# EAGLE design weather (EAGLE 8.2.1)
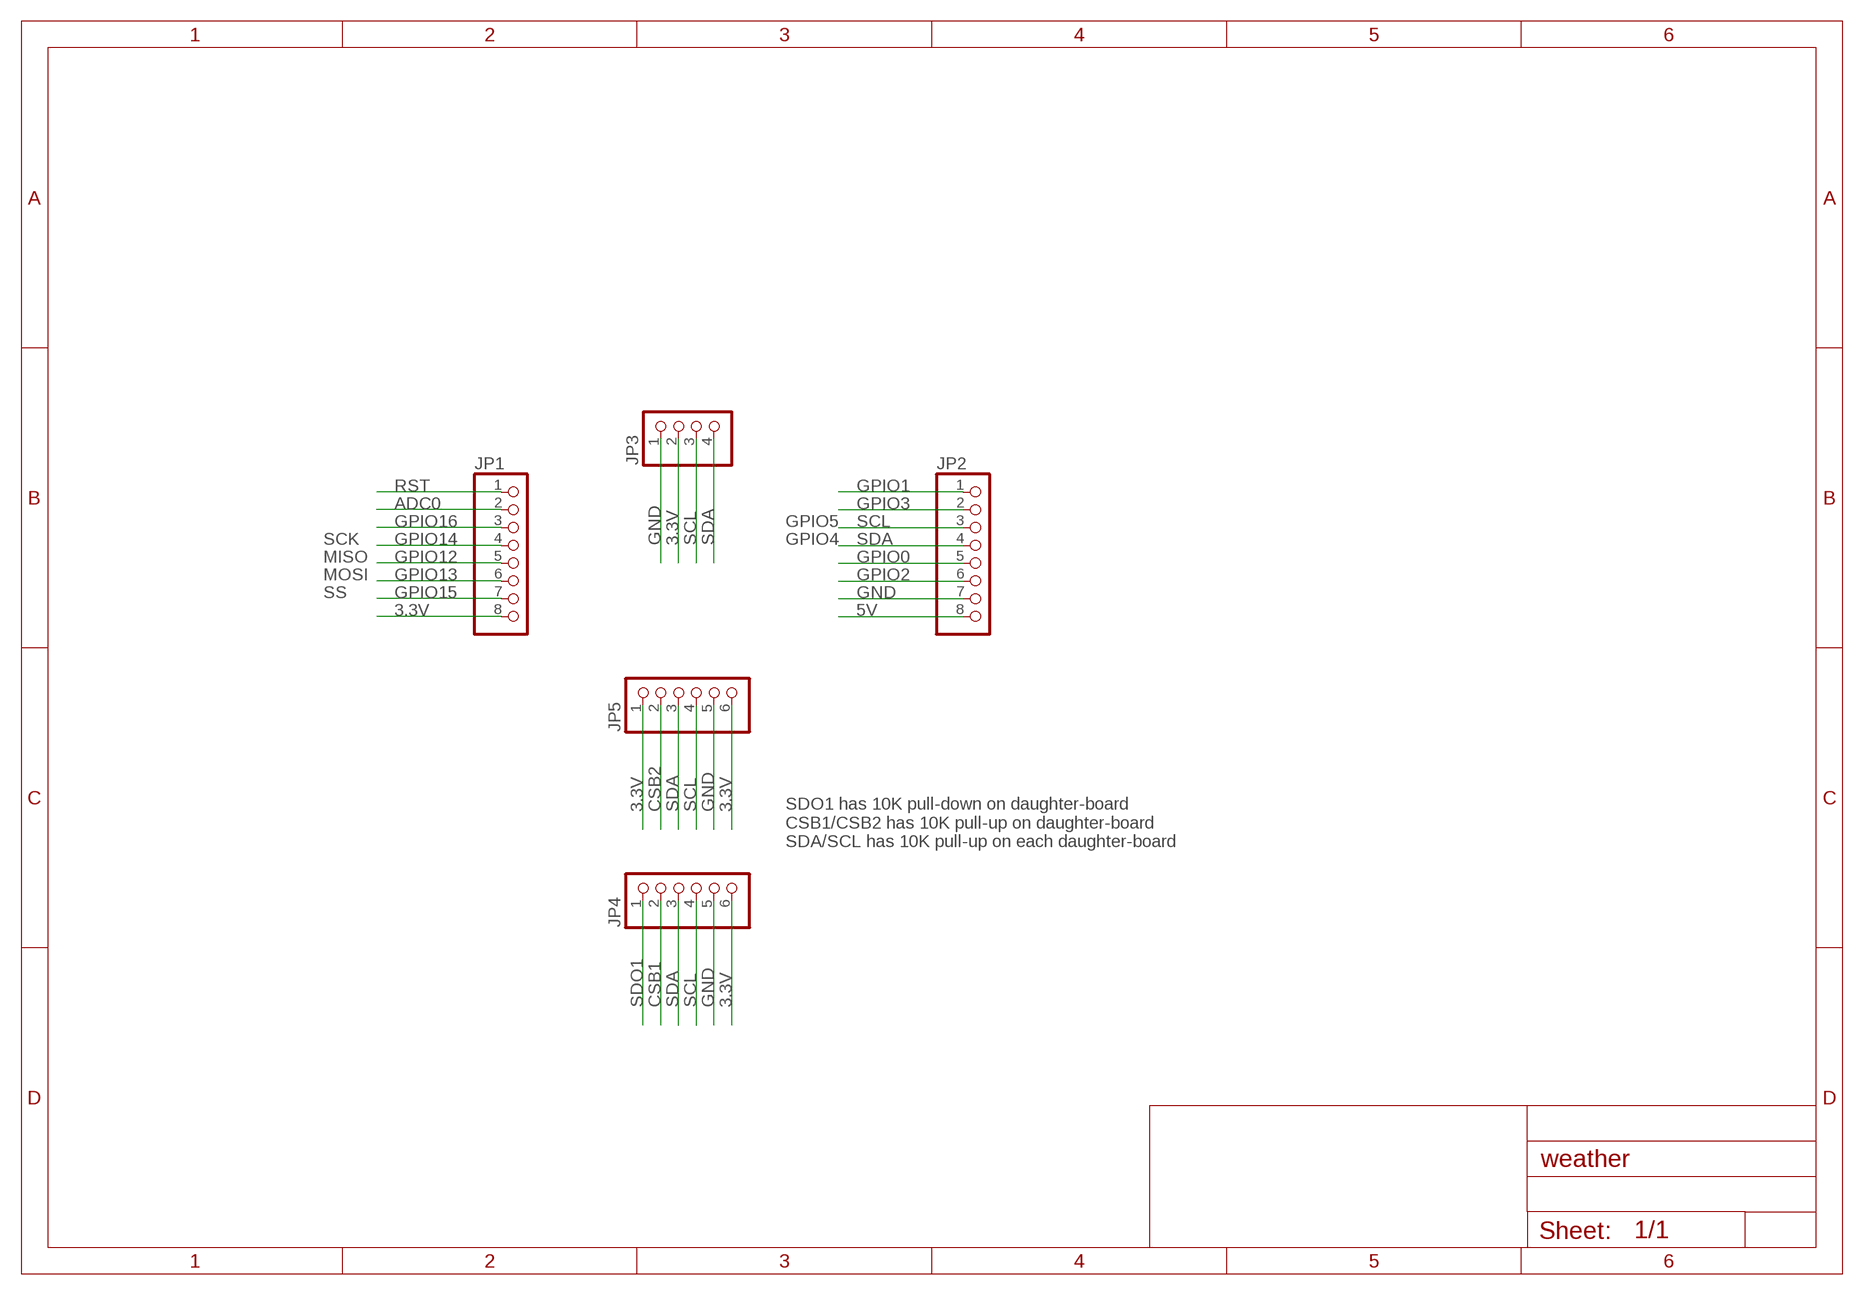
[diagram p0: schematic, sheet 1]

## Parts
JP1  PINHD-1X8  [1X08]
JP2  PINHD-1X8  [1X08]
JP3  PINHD-1X4  [1X04]
JP4  PINHD-1X6  [1X06]
JP5  PINHD-1X6  [1X06]

## Nets
3.3V: JP1.8 JP3.2 JP4.6 JP5.1 JP5.6
5V: JP2.8
ADC0: JP1.2
CSB1: JP4.2
CSB2: JP5.2
GND: JP2.7 JP3.1 JP4.5 JP5.5
GPIO0: JP2.5
GPIO1: JP2.1
GPIO2: JP2.6
GPIO3: JP2.2
GPIO12: JP1.5
GPIO13: JP1.6
GPIO14: JP1.4
GPIO15: JP1.7
GPIO16: JP1.3
RST: JP1.1
SCL: JP2.3 JP3.3 JP4.4 JP5.4
SDA: JP2.4 JP3.4 JP4.3 JP5.3
SDO1: JP4.1

## Notes on the sheet
- GPIO5
- SCK | GPIO4
- MISO
- MOSI
- SS
- SDO1 has 10K pull-down on daughter-board
  CSB1/CSB2 has 10K pull-up on daughter-board
  SDA/SCL has 10K pull-up on each daughter-board

## Library data of the parts
JP1 JP2 = pinhead:PINHD-1X8: PIN HEADER
JP3 = pinhead:PINHD-1X4: PIN HEADER
JP4 JP5 = pinhead:PINHD-1X6: PIN HEADER

## Net classes
0 default: width 0.508 mm

## Board
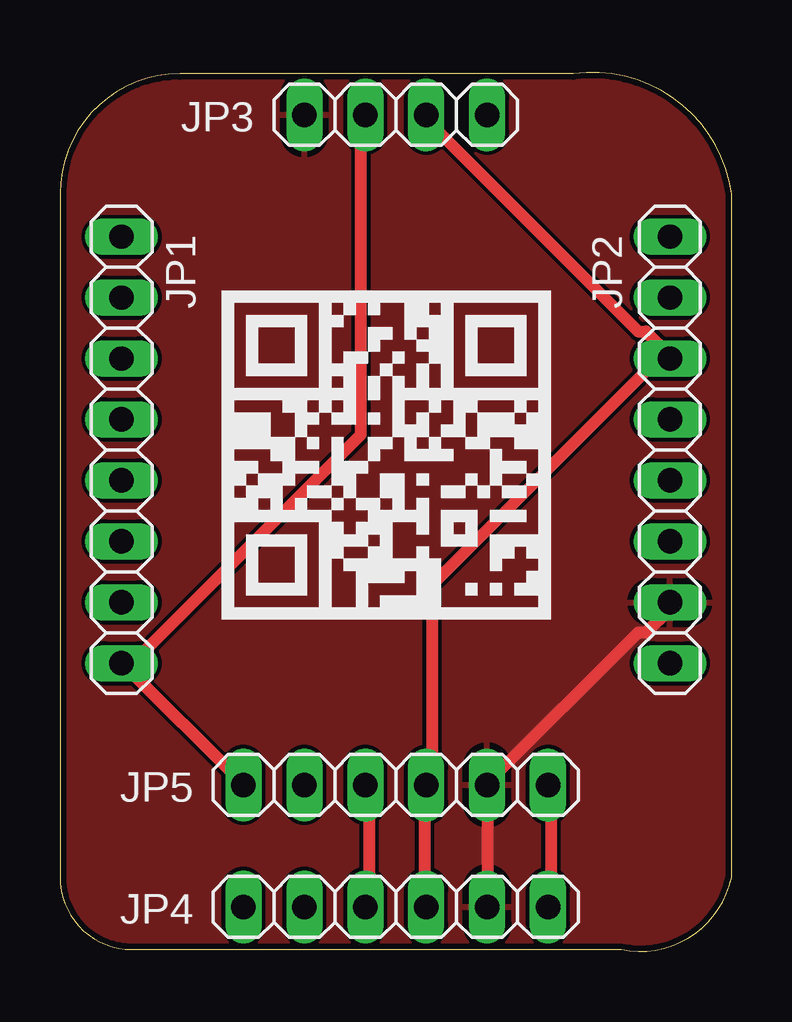
[diagram p1: board, top side]
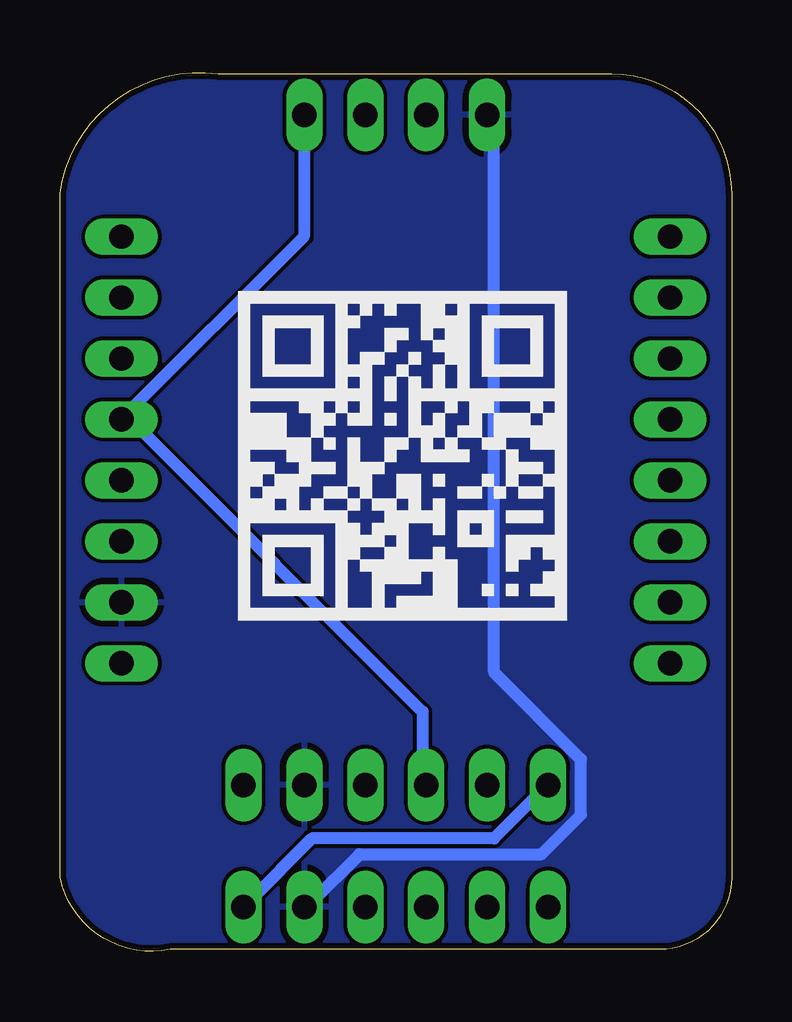
[diagram p2: board, bottom side, seen from below]

Size 28 x 36.63 mm. Coordinates in mm from the lower left corner, seen from the top.
Outline: 0,31.58 0,3.08 arc90 3,0.08 23.4,0.08 arc90 28,3.08 28,31.58 arc90 21.4,36.58 5,36.58 arc90 0,31.58
Copper layers (1*16): Top 0.035mm / dielectric 1.5mm / Bottom 0.035mm
Design rules "SeeedStudio_2layer_DRU_no_angle_20140221": minimum track width 6mil, minimum drill 12mil, track to track 6mil, track to pad 6mil, pad to pad 6mil, via to via 6mil, smd to smd 0mil, copper to edge 10mil, drill to drill 10mil, minimum pad ring 10mil, minimum via ring 6mil, stop-mask expansion 2mil, vias tented up to drill 100mil, thermal gap 10mil

### Footprints (pad centres in the part's own frame; a part is rotated, then mirrored left to right if it is on the bottom)
1X08 = drill 1.016 long: 1 -8.89,0; 2 -6.35,0; 3 -3.81,0; 4 -1.27,0; 5 1.27,0; 6 3.81,0; 7 6.35,0; 8 8.89,0
1X04 = drill 1.016 long: 1 -3.81,0; 2 -1.27,0; 3 1.27,0; 4 3.81,0
1X06 = drill 1.016 long: 1 -6.35,0; 2 -3.81,0; 3 -1.27,0; 4 1.27,0; 5 3.81,0; 6 6.35,0

### Placement (x,y rotation side)
JP1  2.57,20.9 270 top
JP2  25.43,20.9 270 top
JP3  14,34.87 0 top
JP4  14,1.85 0 top
JP5  14,6.93 0 top
U$1  [MADOX]  7,14.08 0 top
U$2  [MADOX]  20.32,14.05 0 bottom

### Tracks (layer width: path | path; a pad name or v marks a point on that pad's centre or on a via)
3.3V
  Top 0.508: JP4.6 20.47,2.06 20.47,6.69 JP5.6 | JP5.1 7.59,7.02 2.64,11.97 JP1.8 2.97,11.97 12.55,21.55 12.55,34.75 JP3.2
  Bottom 0.508: JP4.6 20.14,2.06 17.5,4.71 9.91,4.71 7.92,6.69 JP5.1
GND
  Top 0.508: JP4.5 17.83,2.06 17.83,6.69 JP5.5 17.83,7.02 24.11,13.29 24.43,13.29 25.43,14.28 JP2.7
  Bottom 0.508: JP3.1 9.91,34.75 9.91,11.64 6.27,8.01 6.27,5.7 7.92,4.04 15.52,4.04 17.5,2.06 JP4.5
  pour Bottom: -2.54,39.45 -2.54,-2.46 30.48,-2.46 30.48,39.45
  pour Top: -1.27,38.18 -1.27,-1.19 29.21,-1.19 29.21,38.18
SCL
  Top 0.508: JP4.4 15.19,2.06 15.19,6.69 JP5.4 15.52,7.02 15.52,15.27 25.09,24.85 JP2.3 25.43,24.85 24.43,25.84 24.11,25.84 15.19,34.75 JP3.3
SDA
  Top 0.508: JP4.3 12.88,2.06 12.88,6.69 JP5.3
  Bottom 0.508: JP3.4 17.83,34.75 17.83,29.8 25.43,22.21 JP2.4 25.09,22.21 12.88,9.99 12.88,7.02 JP5.3